# Altium schematic sheet data bluetooth.SchDoc
size A2
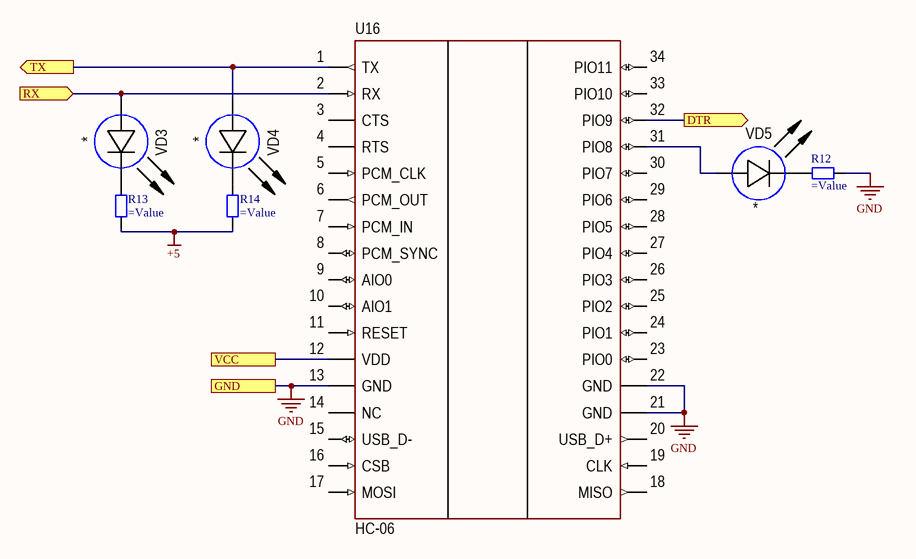
[diagram p0: data bluetooth.SchDoc]

## Parts
R12  (no value)  [res0603]
R13  (no value)  [res0603]
R14  (no value)  [res0603]
U16  HC-06  [MOD: HC-05]
VD3  *  [CH0603LB]
VD4  *  [CH0603LB]
VD5  *  [CH0603LB]

## Ports
DTR (out), GND, RX (in), TX (out), VCC

## Nets
+5: R13.1 R14.1
GND: R12.1 U16.13(GND) U16.21(GND) U16.22(GND) ; port GND
DTR: U16.32(PIO9) ; port DTR
RX: U16.2(RX) VD3.1(A) ; port RX
TX: U16.1(TX) VD4.1(A) ; port TX
VCC: U16.12(VDD) ; port VCC
NetR12_2: R12.2 VD5.2(C)
NetR13_2: R13.2 VD3.2(C)
NetR14_2: R14.2 VD4.2(C)
NetU16_31: U16.31(PIO8) VD5.1(A)

Not connected (* = marked no-connect by the designer): U16 3(CTS) 4(RTS) 5(PCM_CLK) 6(PCM_OUT) 7(PCM_IN) 8(PCM_SYNC) 9(AIO0) 10(AIO1) 11(RESET) 14(NC) 15(USB_D-) 16(CSB) 17(MOSI) 18(MISO) 19(CLK) 20(USB_D+) 23(PIO0) 24(PIO1) 25(PIO2) 26(PIO3) 27(PIO4) 28(PIO5) 29(PIO6) 30(PIO7) 33(PIO10) 34(PIO11)

## Library data of the parts
R12-R14 = Resistor SMD
U16 = HC-06: Bluetooth; Manufacturer: China; Model: HC-06; ComponentKind: Bluetooth 2.4GHz; HelpURL: https://ru.aliexpress.com/wholesale?minPrice=&maxPrice=&isBigSale=n&isFreeShip=y&isNew=n&isFavorite=n&isMobileExclusive=n&isLocalReturn=n&shipFromCountry=&shipCompanies=&SearchText=HC-06&CatId=0&initiative_id=SB_20170806222546&needQuery=y
VD3-VD5 = LED: Manufacturer: *; Model: *; HelpURL: *; ComponentKind: *; Value: *